# EAGLE design Grove expansion v5 (EAGLE 9.5.0)

## Sheet 1 of 2
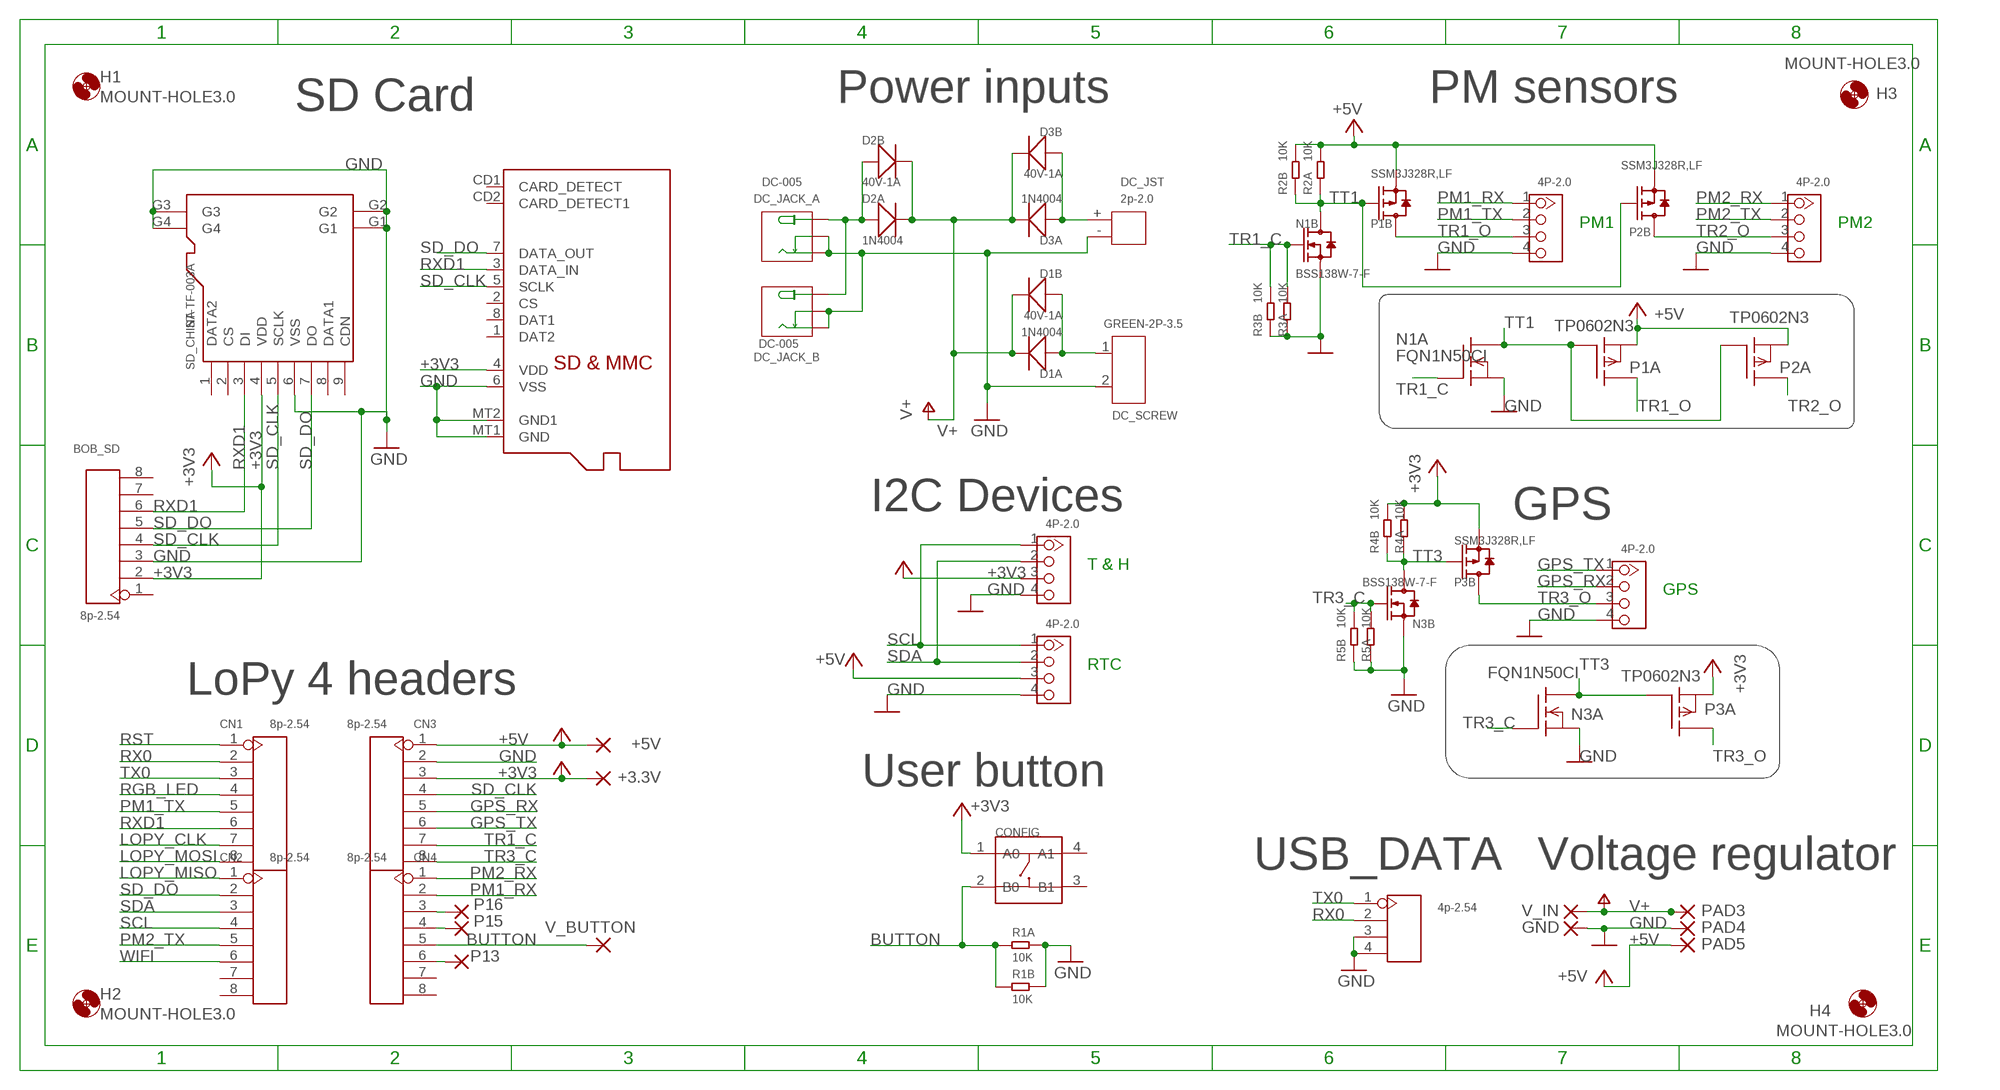
[diagram p0: schematic, sheet 1]

### Parts
+3.3V  3.3V  2,15/1,0  [2,15/1,0]
+5V  5V  2,15/1,0  [2,15/1,0]
BOB_SD  8p-2.54  DIP-BLACK-FEMALE-HEADER-VERT(8P-2.54)  [H8-2.54]
CN1  8p-2.54  DIP-BLACK-FEMALE-HEADER-VERT(8P-2.54)  [H8-2.54]
CN2  8p-2.54  DIP-BLACK-FEMALE-HEADER-VERT(8P-2.54)  [H8-2.54]
CN3  8p-2.54  DIP-BLACK-FEMALE-HEADER-VERT(8P-2.54)  [H8-2.54]
CN4  8p-2.54  DIP-BLACK-FEMALE-HEADER-VERT(8P-2.54)  [H8-2.54]
CONFIG  DIP-SWITCH-TACTILE-SPST-NO/TS-1109(4P-D6.0MM)'TS-1109'  [SW4-6.0X6.0X5.0MM]
D1A  1N4004  DIP-DIODE-400V-1A(DO-41)  [DO-41]
D1B  40V-1A  SMD-DIODE-SCHOTTKY-40V-1A(DO-214AC)  [DO-214AC]
D2A  1N4004  DIP-DIODE-400V-1A(DO-41)  [DO-41]
D2B  40V-1A  SMD-DIODE-SCHOTTKY-40V-1A(DO-214AC)  [DO-214AC]
D3A  1N4004  DIP-DIODE-400V-1A(DO-41)  [DO-41]
D3B  40V-1A  SMD-DIODE-SCHOTTKY-40V-1A(DO-214AC)  [DO-214AC]
DC_JACK_A  DC-005  CONN-POWER-JACK-2.1MM(DC-005)  [DCJ3P-14.2X11.0X9.0MM]
DC_JACK_B  DC-005  CONN-POWER-JACK-2.1MM(DC-005)  [DCJ3P-14.2X11.0X9.0MM]
DC_JST  2p-2.0  DIP-JST-2P-2.0  [H2-2.0-6X4.5MM]
DC_SCREW  GREEN-2P-3.5  SCREW-TERMINAL-GREEN(2P-3.5)  [H2-3.5-7.0X7.0MM]
GND  0V  2,15/1,0  [2,15/1,0]
GPS-(DIG)  4P-2.0  GROVE-CONNECTOR-DIP(4P-2.0)  [HW4-2.0]
H1  MOUNT-HOLE3.0  [3,0]
H2  MOUNT-HOLE3.0  [3,0]
H3  MOUNT-HOLE3.0  [3,0]
H4  MOUNT-HOLE3.0  [3,0]
N1A  FQN1N50CI  [TO92-INLINE]
N1B  BSS138W-7-F  SMD-MOSFET-N-CH-50V-200MA-BSS138W-7-F(SOT-23)  [SOT-23]
N3A  FQN1N50CI  [TO92-INLINE]
N3B  BSS138W-7-F  SMD-MOSFET-N-CH-50V-200MA-BSS138W-7-F(SOT-23)  [SOT-23]
P1A  TP0602N3  [TO-92]
P1B  SSM3J328R,LF  SMD-MOSFET-P-CH-20V-6A-SSM3J328R(SOT-23)  [SOT-23]
P2A  TP0602N3  [TO-92]
P2B  SSM3J328R,LF  SMD-MOSFET-P-CH-20V-6A-SSM3J328R(SOT-23)  [SOT-23]
P3A  TP0602N3  [TO-92]
P3B  SSM3J328R,LF  SMD-MOSFET-P-CH-20V-6A-SSM3J328R(SOT-23)  [SOT-23]
P13  2,15/1,0  [2,15/1,0]
P15  2,15/1,0  [2,15/1,0]
P16  2,15/1,0  [2,15/1,0]
PAD3  12V  1,6/0,8  [1,6/0,8]
PAD4  0V  1,6/0,8  [1,6/0,8]
PAD5  5V  1,6/0,8  [1,6/0,8]
PM1-(UART)  4P-2.0  GROVE-CONNECTOR-DIP(4P-2.0)  [HW4-2.0]
PM2-(UART)  4P-2.0  GROVE-CONNECTOR-DIP(4P-2.0)  [HW4-2.0]
R1A  10K  DIP-RES-10K-5%-1/4W(PR-D2.3XL6.5MM)  [PR-D2.3XL6.5MM]
R1B  10K  SMD-RES-10K-1%-1/10W(0603)  [R0603]
R2A  10K  DIP-RES-10K-5%-1/4W(PR-D2.3XL6.5MM)  [PR-D2.3XL6.5MM]
R2B  10K  SMD-RES-10K-1%-1/10W(0603)  [R0603]
R3A  10K  DIP-RES-10K-5%-1/4W(PR-D2.3XL6.5MM)  [PR-D2.3XL6.5MM]
R3B  10K  SMD-RES-10K-1%-1/10W(0603)  [R0603]
R4A  10K  DIP-RES-10K-5%-1/4W(PR-D2.3XL6.5MM)  [PR-D2.3XL6.5MM]
R4B  10K  SMD-RES-10K-1%-1/10W(0603)  [R0603]
R5A  10K  DIP-RES-10K-5%-1/4W(PR-D2.3XL6.5MM)  [PR-D2.3XL6.5MM]
R5B  10K  SMD-RES-10K-1%-1/10W(0603)  [R0603]
RTC-(I2C)  4P-2.0  GROVE-CONNECTOR-DIP(4P-2.0)  [HW4-2.0]
SD_CHINA  ST-TF-003A  MICRO-SD-CARD-SOCKET-9P(ST-TF-003A)  [MICRO-SD9+4P-SMD-16.1X14.5X1.85MM]
SD_UK  MICROSD  [MICROSD]
TH-(I2C)  4P-2.0  GROVE-CONNECTOR-DIP(4P-2.0)  [HW4-2.0]
USB_DATA  4p-2.54  DIP-BLACK-FEMALE-HEADER-VERT(4P-2.54)  [H4-2.54]
V_BUTTON  3.3V  2,15/1,0  [2,15/1,0]
V_IN  12V  2,15/1,0  [2,15/1,0]

### Nets
+3V3: +3.3V.1(P) BOB_SD.2 CN3.3 CONFIG.1(A0) P3A.1(S) P3B.2(S) R4A.2 R4B.2 SD_CHINA.4(VDD) SD_UK.4(VDD) TH-(I2C).3
+5V: +5V.1(P) CN3.1 P1A.1(S) P1B.2(S) P2A.1(S) P2B.2(S) PAD5.1(P) R2A.2 R2B.2 RTC-(I2C).3
BUTTON: CN4.5 CONFIG.2(B0) R1A.1 R1B.1 V_BUTTON.1(P)
GND: BOB_SD.3 CN3.2 DC_JACK_A.-1(-) DC_JACK_A.-2(CDN) DC_JACK_B.-1(-) DC_JACK_B.-2(CDN) DC_JST.- DC_SCREW.2 GND.1(P) GPS-(DIG).4 N1A.3(S) N1B.2(S) N3A.3(S) N3B.2(S) PAD4.1(P) PM1-(UART).4 PM2-(UART).4 R1A.2 R1B.2 R3A.1 R3B.1 R5A.1 R5B.1 RTC-(I2C).4 SD_CHINA.6(VSS) SD_CHINA.G1 SD_CHINA.G2 SD_CHINA.G3 SD_CHINA.G4 SD_UK.6(VSS) SD_UK.MT1(GND) SD_UK.MT2(GND1) TH-(I2C).4 USB_DATA.3 USB_DATA.4
GPS_RX: CN3.5 GPS-(DIG).2
GPS_TX: CN3.6 GPS-(DIG).1
JACK_V+: D2A.1(+) D2B.1(+) DC_JACK_A.+ DC_JACK_B.+
JST_V+: D3A.1(+) D3B.1(+) DC_JST.+
LOPY_CLK: CN1.7
LOPY_MISO: CN2.1
LOPY_MOSI: CN1.8
P13: CN4.6 P13.1(P)
P15: CN4.4 P15.1(P)
P16: CN4.3 P16.1(P)
PM1_RX: CN4.2 PM1-(UART).1
PM1_TX: CN1.5 PM1-(UART).2
PM2_RX: CN4.1 PM2-(UART).1
PM2_TX: CN2.5 PM2-(UART).2
RGB_LED: CN1.4
RST: CN1.1
RX0: CN1.2 USB_DATA.2
RXD1: BOB_SD.6 CN1.6 SD_CHINA.3(DI) SD_UK.3(DATA_IN)
SCL: CN2.4 RTC-(I2C).1 TH-(I2C).1
SCREW_V+: D1A.1(+) D1B.1(+) DC_SCREW.1
SD_CLK: BOB_SD.4 CN3.4 SD_CHINA.5(SCLK) SD_UK.5(SCLK)
SD_DO: BOB_SD.5 CN2.2 SD_CHINA.7(DO) SD_UK.7(DATA_OUT)
SDA: CN2.3 RTC-(I2C).2 TH-(I2C).2
TR1_C: CN3.7 N1A.2(G) N1B.1(G) R3A.2 R3B.2
TR1_O: P1A.3(D) P1B.3(D) PM1-(UART).3
TR2_O: P2A.3(D) P2B.3(D) PM2-(UART).3
TR3_C: CN3.8 N3A.2(G) N3B.1(G) R5A.2 R5B.2
TR3_O: GPS-(DIG).3 P3A.3(D) P3B.3(D)
TT1: N1A.1(D) N1B.3(D) P1A.2(G) P1B.1(G) P2A.2(G) P2B.1(G) R2A.1 R2B.1
TT3: N3A.1(D) N3B.3(D) P3A.2(G) P3B.1(G) R4A.1 R4B.1
TX0: CN1.3 USB_DATA.1
V+: D1A.2(-) D1B.2(-) D2A.2(-) D2B.2(-) D3A.2(-) D3B.2(-) PAD3.1(P) V_IN.1(P)
WIFI: CN2.6
Unconnected: BOB_SD.1 BOB_SD.7 BOB_SD.8 CN2.7 CN2.8 CN4.7 CN4.8 CONFIG.3(B1) CONFIG.4(A1) SD_CHINA.1(DATA2) SD_CHINA.2(CS) SD_CHINA.8(DATA1) SD_CHINA.9(CDN) SD_UK.1(DAT2) SD_UK.2(CS) SD_UK.8(DAT1) SD_UK.CD1(CARD_DETECT) SD_UK.CD2(CARD_DETECT1)

### Notes on the sheet
- SD Card | Power inputs | PM sensors
- PM1 | PM2
- I2C Devices | GPS
- T & H
- GPS
- RTC
- LoPy 4 headers
- User button
- Voltage regulator

## Sheet 2 of 2

## Library data of the parts
+3.3V +5V GND P13 P15 P16 V_BUTTON V_IN = wirepad:2,15/1,0: THROUGH-HOLE PAD
BOB_SD CN1-CN4 = OPL_Connector:DIP-BLACK-FEMALE-HEADER-VERT(8P-2.54): 320030061; MPN: F185-1108A1BSYC1
CONFIG = OPL_Switch:DIP-SWITCH-TACTILE-SPST-NO/TS-1109(4P-D6.0MM): 311020024
D1A D2A D3A = OPL_Discrete_Semiconductor:DIP-DIODE-400V-1A(DO-41): 304010008; MPN: 1N4004
D1B D2B D3B = OPL_Discrete_Semiconductor:SMD-DIODE-SCHOTTKY-40V-1A(DO-214AC): 304020027; MPN: 1N5819
DC_JACK_A DC_JACK_B = OPL_Connector:CONN-POWER-JACK-2.1MM(DC-005): 320120003; MPN: DC-005
DC_JST = OPL_Connector:DIP-JST-2P-2.0: 320110049
DC_SCREW = OPL_Connector:SCREW-TERMINAL-GREEN(2P-3.5): 320110028
GPS-(DIG) PM1-(UART) PM2-(UART) RTC-(I2C) TH-(I2C) = OPL_Connector:GROVE-CONNECTOR-DIP(4P-2.0): 320110033
H1-H4 = holes:MOUNT-HOLE: MOUNTING HOLE with drill center marker
N1A N3A = adafruit:FQN1N50C: N-Channel Enhancement MOSFET 500V, 0.4A, 6.0 Ohm
N1B N3B = OPL_Discrete_Semiconductor:SMD-MOSFET-N-CH-50V-200MA-BSS138W-7-F(SOT-23): 305030000; MPN: BSS138W-7-F
P1A P2A P3A = transistor-fet:TP0602N3: P-Channel Enhancement MOSFET -20V; -2A; 2,0Ohm
P1B P2B P3B = OPL_Discrete_Semiconductor:SMD-MOSFET-P-CH-20V-6A-SSM3J328R(SOT-23): 305030075; MPN: SSM3J328R,LF
PAD3-PAD5 = wirepad:1,6/0,8: THROUGH-HOLE PAD
R1A R2A R3A R4A R5A = OPL_Resistor:DIP-RES-10K-5%-1/4W(PR-D2.3XL6.5MM): 301020001; MPN: FHCFR-1/4W-103J
R1B R2B R3B R4B R5B = OPL_Resistor:SMD-RES-10K-1%-1/10W(0603): 301011970; MPN: RC0603FR-0710KL
SD_CHINA = OPL_Connector:MICRO-SD-CARD-SOCKET-9P(ST-TF-003A): 320090000; MPN: ST-TF-003A
SD_UK = adafruit:MICROSD: Micro-SD / Transflash card holder with SPI pinout For the 3M # 2908-05WB-MG and/or 4UCON #19656 push-push type
USB_DATA = OPL_Connector:DIP-BLACK-FEMALE-HEADER-VERT(4P-2.54): 320030017; MPN: F185-1104A1BSYA1

## Board
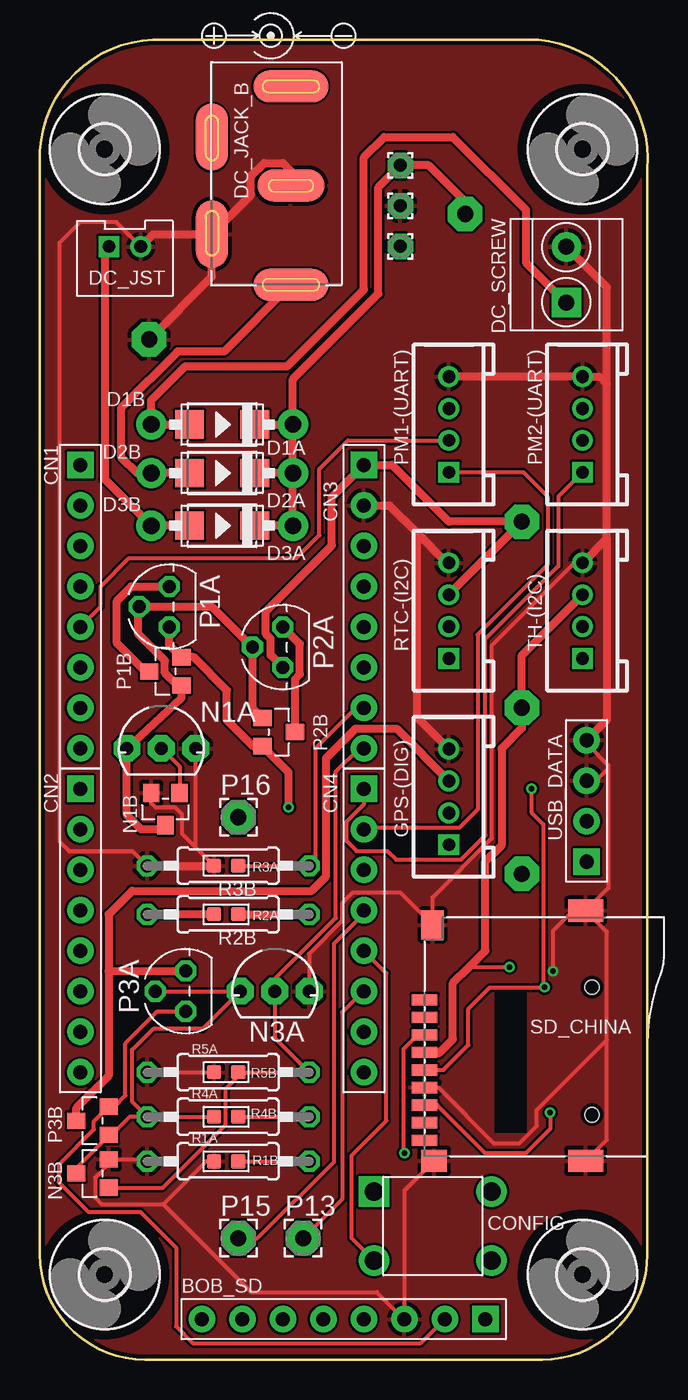
[diagram p1: board, top side]
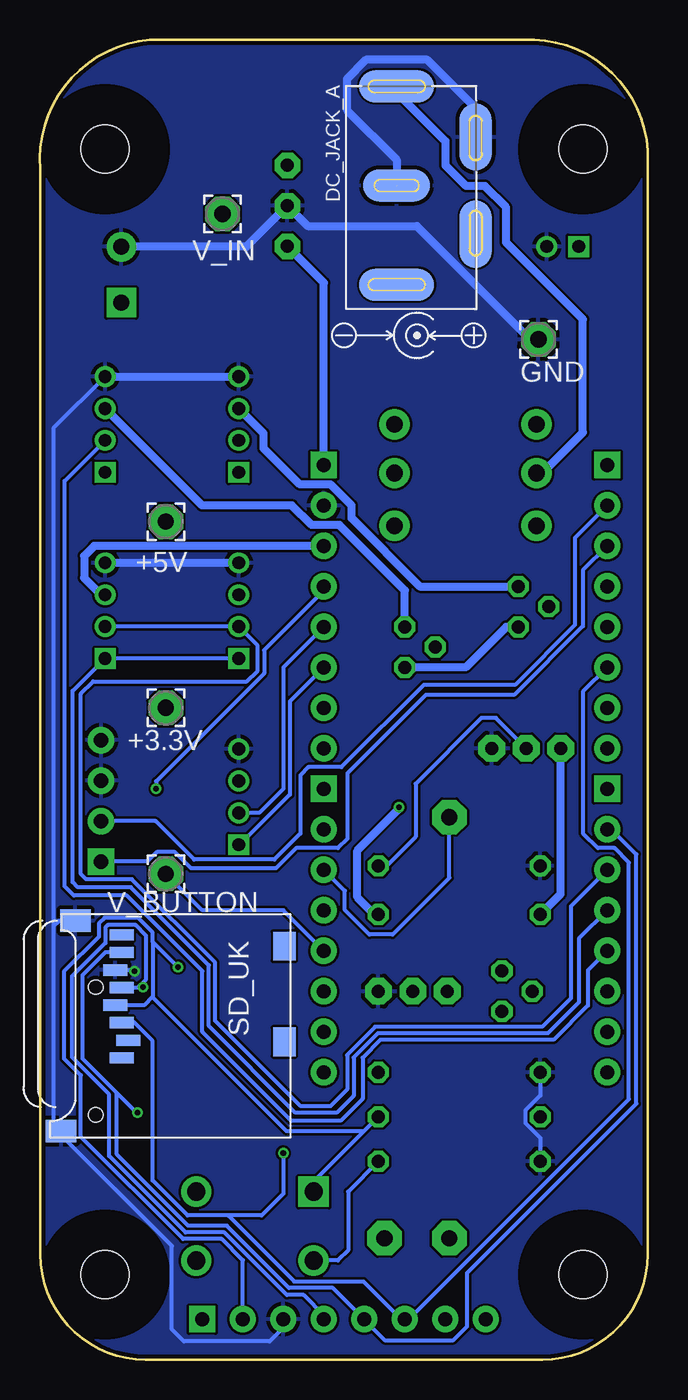
[diagram p2: board, bottom side, seen from below]

Size 38.13 x 82.8 mm. Coordinates in mm from the lower left corner, seen from the top.
Outline: 0,6.6 0,75.18 arc-90 7.11,82.8 31.24,82.8 arc-90 38.1,74.68 38.1,6.6 arc-90 31.5,0 6.6,0 arc-90 0,6.6
Copper layers (1*16): Top 0.035mm / dielectric 1.5mm / Bottom 0.035mm
Design rules "SeeedStudio_2layer_DRU_no_angle_20140221": minimum track width 6mil, minimum drill 12mil, track to track 6mil, track to pad 6mil, pad to pad 6mil, via to via 6mil, smd to smd 0mil, copper to edge 10mil, drill to drill 10mil, minimum pad ring 10mil, minimum via ring 6mil, stop-mask expansion 2mil, vias tented up to drill 100mil, thermal gap 10mil

### Footprints (pad centres in the part's own frame; a part is rotated, then mirrored left to right if it is on the bottom)
2,15/1,0 = drill 1.016 pad 2.159 octagon: 1 0,0
H8-2.54 = drill 0.889 pad 1.651 square: 1 0,8.89 | drill 0.889 pad 1.651: 2 0,6.35; 3 0,3.81; 4 0,1.27; 5 0,-1.27; 6 0,-3.81; 7 0,-6.35; 8 0,-8.89
SW4-6.0X6.0X5.0MM = drill 1.143 pad 1.905 square: 1 -3.683,2.159 | drill 1.143 pad 1.905: 2 -3.683,-2.159; 3 3.683,-2.159; 4 3.683,2.159
DO-41 = drill 1.041 pad 1.905: 1 -4.445,0; 2 4.445,0
DO-214AC = smd 1.8 x 1.77: 1 -2.042,0; 2 2.042,0
DCJ3P-14.2X11.0X9.0MM = smd 2 x 4.7: + 3.175,0 | smd 2 x 4.7 bottom: +1 3.175,0 | smd 2 x 4.2: -1 -3.048,0 | smd 4.2 x 2: -2 0,-4.953 | smd 2 x 4.2 bottom: -3 -3.048,0 | smd 4.2 x 2 bottom: -4 0,-4.953
H2-2.0-6X4.5MM = drill 0.8 pad 1.3 square: + -1,0.75 | drill 0.8 pad 1.3: - 1,0.75
H2-3.5-7.0X7.0MM = drill 1 pad 1.85 square: 1 -1.75,0 | drill 1 pad 1.85: 2 1.75,0
HW4-2.0 = drill 0.8 pad 1.27 square: 1 -3,0 | drill 0.8 pad 1.27: 2 -1,0; 3 1,0; 4 3,0
3,0 = hole 3: 0,0
TO92-INLINE = drill 0.813 pad 1.676 octagon: 1 -2.159,0; 2 0,0; 3 2.159,0
SOT-23 = smd 1.016 x 1.143: 1 -0.889,-1.016; 2 0.889,-1.016; 3 0,1.016
TO-92 = drill 0.813 octagon: 1 -1.27,0; 2 0,1.905; 3 1.27,0
1,6/0,8 = drill 0.813 pad 1.6 octagon: 1 0,0
PR-D2.3XL6.5MM = drill 0.813 octagon: 1 -4.953,0; 2 5.207,0
R0603 = smd 0.889 x 0.889: 1 0,0.762; 2 0,-0.762
MICRO-SD9+4P-SMD-16.1X14.5X1.85MM = smd 1.6 x 0.7: 1 0,2.25; 2 0,1.15; 3 0,0.05; 4 0,-1.05; 5 0,-2.15; 6 0,-3.25; 7 0,-4.35; 8 0,-5.45; 9 0,-6.55 | smd 1.6 x 1.4: G1 0.6,-7.85 | smd 2.2 x 1.4: G2 10.1,-7.85; G3 10.1,7.85 | smd 1.4 x 1.8: G4 0.5,6.95 | hole 0.9: 10.5,-4.95; 10.5,3.05
MICROSD = smd 0.7 x 1.5: 1 9,-10.64; 2 7.9,-10.24; 3 6.8,-10.64; 4 5.7,-11.04; 5 4.6,-10.64; 6 3.5,-11.04; 7 2.4,-10.64; 8 1.3,-10.64 | smd 1.8 x 1.4: CD1 2,-0.44; CD2 8,-0.44 | smd 1.4 x 1.9: MT1 0.4,-13.54; MT2 13.6,-14.44
H4-2.54 = drill 0.889 pad 1.651 square: 1 0,3.81 | drill 0.889 pad 1.651: 2 0,1.27; 3 0,-1.27; 4 0,-3.81

### Placement (x,y rotation side)
+3.3V  30.23,40.89 0 bottom
+5V  30.23,52.58 0 bottom
BOB_SD  19.05,2.54 270 top
CN1  2.54,47.24 0 top
CN2  2.54,26.92 0 top
CN3  20.32,47.24 0 top
CN4  20.32,26.92 0 top
CONFIG  24.64,8.38 0 top
D1A  11.43,58.67 0 top
D1B  11.43,58.67 0 top
D2A  11.43,55.63 0 top
D2B  11.43,55.63 0 top
D3A  11.43,52.32 0 top
D3B  11.43,52.32 0 top
DC_JACK_A  15.75,76.71 90 bottom
DC_JACK_B  15.75,70.61 270 top
DC_JST  5.33,69.09 0 top
DC_SCREW  33.02,68.07 90 top
GND  6.86,64.01 0 bottom
GPS-(DIG)  25.65,35.31 90 top
H1  34.04,5.33 0 top
H2  4.06,75.95 0 top
H3  34.04,75.95 0 top
H4  4.06,5.33 0 top
N1A  7.62,38.35 0 top
N1B  7.87,34.54 180 top
N3A  14.73,23.11 0 top
N3B  3.3,11.68 90 top
P1A  8.13,47.24 90 top
P1B  7.87,43.18 90 top
P2A  15.24,44.7 90 top
P2B  14.99,39.37 270 top
P3A  9.14,23.11 90 top
P3B  3.3,14.99 90 top
P13  16.51,7.62 0 top
P15  12.45,7.62 0 top
P16  12.45,34.04 0 top
PAD3  22.61,74.93 90 top
PAD4  22.61,72.39 90 top
PAD5  22.61,69.85 90 top
PM1-(UART)  25.65,58.67 90 top
PM2-(UART)  34.04,58.67 90 top
R1A  11.94,12.45 180 top
R1B  11.68,12.45 270 top
R2A  11.68,27.94 0 top
R2B  11.68,27.94 90 top
R3A  11.68,30.99 0 top
R3B  11.68,30.99 90 top
R4A  11.68,15.24 0 top
R4B  11.68,15.24 90 top
R5A  11.68,18.03 0 top
R5B  11.68,18.03 90 top
RTC-(I2C)  25.65,46.99 90 top
SD_CHINA  24.13,20.32 0 top
SD_UK  22.35,27.94 270 bottom
TH-(I2C)  34.04,46.99 90 top
USB_DATA  34.29,35.05 180 top
V_BUTTON  30.23,30.48 0 bottom
V_IN  26.67,71.88 0 bottom

### Tracks (layer width: path | path; a pad name or v marks a point on that pad's centre or on a via)
+3V3  (via drill 0.35)
  Top 0.254: BOB_SD.2 23.89,1.03 9.6,1.03 8.55,2.08 8.55,7.03 6.31,9.27 3.04,9.27 1.18,11.13 1.18,12.23 3.39,14.44 3.39,14.95 P3B.2 4.66,15.88 5.36,16.58 5.36,19.84 7.37,21.84 P3A.1 | R4B.2 R4A.2 | 25.05,19.23 24.17,19.23 SD_CHINA.4 | 26.92,24.64 v29.46,24.64
  Top 0.508: 25.05,19.23 25.91,20.1 25.91,23.62 26.92,24.64 27.94,25.65 27.94,31.24 28.96,32.26 28.96,38.35 30.23,39.62 +3.3V.1 30.23,44.18 TH-(I2C).3
  Bottom 0.254: 31.05,26.22 31.05,22.77 31.07,22.75 | 31.07,22.75 31.58,22.24 SD_UK.4 | BOB_SD.2 25.4,6.25 26.73,7.58 29.15,7.58 35.56,13.99 35.56,17.85 36.61,18.9 36.61,24.35 34.43,26.53 34.43,27.36 34.07,27.72 31.97,27.72 31.05,26.8 31.05,26.22 | 31.07,22.75 22.65,14.33 17.83,14.33 16.91,15.24 R4A.2 20.95,11.18 CONFIG.1 | v29.46,24.64 31.05,26.22
  Bottom 0.508: TH-(I2C).3 34.3,47.99 35.35,49.04 35.35,50.43 34.73,51.05 CN3.3
+5V  (via drill 0.35)
  Top 0.508: R2B.2 R2A.2 | RTC-(I2C).3 30.23,52.56 +5V.1 25.65,52.58 22.1,56.13 CN3.1 18.31,54.13 18.31,51.08 14.17,46.94 14.17,45.53 14.48,45.23 14.48,44.2 P2A.1 | v15.61,34.66 15.61,36.84 P2B.2 13.39,38.48 11.73,40.13 11.73,41.99 9.65,44.07 P1B.2 8.13,44.83 P1A.1
  Bottom 0.508: CN3.1 20.32,67.56 PAD5.1 | v15.61,34.66 15.61,34.54 18.21,31.94 18.21,29.01 17.14,27.94 R2A.2 | P1A.1 8.89,45.97 11.43,43.43 P2A.1
BUTTON
  Top 0.254: CN4.5 21.73,24.24 21.73,14.99 19.56,12.81 19.56,7.62 CONFIG.2 | R1B.1 R1A.1
  Bottom 0.254: V_BUTTON.1 27.94,28.19 22.86,28.19 CN4.5 | R1A.1 18.8,10.54 18.8,6.86 19.43,6.22 CONFIG.2
GND  (via drill 0.35)  (1 unrouted)
  Top 0.254: 24.73,12.82 SD_CHINA.G1 22.86,10.6 BOB_SD.3 22.86,2.5 21.13,4.23 13.26,4.23 7.74,9.75 | DC_JST.- 4.8,71.37 2.54,71.37 1.22,70.05 1.22,32.52 1.83,31.92 5.8,31.92 R3A.1 | USB_DATA.4 34.29,38.65 35.65,37.29 35.65,37.08 | 35.65,37.08 35.65,29.59 SD_CHINA.G3 | 11.23,18.03 R5B.1 R5A.1 | SD_CHINA.G3 35.56,26.84 35.56,20.07 | SD_CHINA.G3 33.44,28.17 32.19,26.92 v32.19,24.38 | SD_CHINA.G2 35.56,13.8 35.56,20.07 | SD_CHINA.6 24.99,17.07 28.48,13.58 30.07,13.58 31.16,14.67 31.16,15.67 35.56,20.07 | R1A.2 6.6,12.57 N3B.2 4.45,12.45 4.45,12.4 3.47,11.42 3.47,10.17 3.88,9.75 7.74,9.75 | TH-(I2C).4 33.53,49.99 28.35,44.81 28.35,32.72 24.63,29 SD_CHINA.G4 22.6,29.3 19.61,29.3 18.97,28.66 18.97,27.54 16.89,25.46 N3A.3 | R1B.2 10.43,12.45 7.74,9.75 | USB_DATA.3 34.89,36.32 35.65,37.08 | 6.73,35.31 N1B.2 6.99,34.92 7.28,34.63 8.5,34.63 8.91,34.21 8.91,32.99 R3B.1 9.78,32.13 N1A.3
  Top 0.508: DC_JST.- 7.11,70.61 DC_JACK_B.-2 | DC_JACK_B.-2 13.24,73.06 13.24,74.24 14.06,75.07 15.25,75.07 15.75,74.57 DC_JACK_B.-1 | N1B.2 7.06,35.64 | R3A.1 R3B.1 | 35.56,51.51 TH-(I2C).4 | 35.56,51.51 35.56,40.13 USB_DATA.4 | CN3.2 21.93,53.59 23.66,51.86 | RTC-(I2C).4 25.53,49.99 23.66,51.86 | DC_SCREW.2 35.56,67.28 35.56,61.21 | PM1-(UART).4 PM2-(UART).4 35.1,61.67 35.56,61.21 | GPS-(DIG).4 23.66,40.3 23.66,51.86 | GND.1 10.79,67.95 DC_JACK_B.-2 | 35.56,51.51 35.56,61.21
  Bottom 0.254: PM2-(UART).4 37.27,58.44 37.27,27.18 | 37.27,27.18 37.27,14.67 36.95,14.34 SD_UK.MT2 36.79,14.09 29.84,7.14 29.84,1.89 29.1,1.14 23.71,1.14 22.86,1.99 BOB_SD.3 | SD_UK.6 32.25,24.44 v32.19,24.38 | R5A.1 6.73,16.57 7.67,15.63 7.67,14.85 6.73,13.91 R1A.2 | SD_UK.MT1 36.91,27.54 37.27,27.18
  Bottom 0.508: DC_JACK_A.-2 10.79,78.52 13.81,81.54 17.68,81.54 18.88,80.35 18.88,78.4 15.75,75.27 DC_JACK_B.-1 | RTC-(I2C).4 TH-(I2C).4 | GND.1 7.37,64.01 14.48,71.12 21.34,71.12 PAD4.1 25.17,69.82 DC_SCREW.2 | PM1-(UART).4 PM2-(UART).4 33.32,61.67
  pour Top: -1.27,85.34 -1.27,-1.02 39.37,-1.02 39.37,85.34
  pour Bottom: -2.79,86.61 -2.79,-2.29 40.64,-2.29 40.64,86.61
GPS_RX
  Bottom 0.254: CN3.5 22.86,43.43 22.86,35.81 24.37,34.31 GPS-(DIG).2
GPS_TX
  Bottom 0.254: CN3.6 22.45,41.3 22.45,35.46 25.61,32.31 GPS-(DIG).1
JACK_V+
  Top 0.508: D2B.1 D2A.1 6.1,55.63 5.08,56.64 5.08,59.69 8.64,63.25 11.56,63.25 DC_JACK_B.+
  Bottom 0.508: DC_JACK_A.+ 15.75,79.5 12.7,76.45 12.7,74.93 11.4,73.63 10.21,73.63 8.88,72.3 8.88,70.09 4.06,65.28 4.06,58.17 6.6,55.63 D2A.1
JST_V+
  Top 0.508: D3B.1 D3A.1 4.06,55.24 4.06,69.57 DC_JST.+
P13
  Top 0.254: CN4.6 20.28,23.11 18.96,21.79 18.96,10.07 P13.1
P15
  Top 0.254: P15.1 13.65,7.62 18.45,12.42 18.45,26.11 20.32,27.98 CN4.4
P16
  Bottom 0.254: CN4.3 19,29.41 19,28.21 17.46,26.67 16,26.67 12.45,30.23 P16.1
PM1_RX
  Top 0.254: PM1-(UART).1 30.32,55.67 31.84,54.16 31.84,49.87 27.45,45.48 27.45,34.53 26.3,33.37 20.42,33.37 CN4.2
PM1_TX
  Top 0.254: CN1.5 3.81,47.24 3.81,48.51 5.59,50.29 16.09,50.29 17.53,51.72 17.53,55.88 19.32,57.67 PM1-(UART).2
PM2_RX
  Top 0.254: CN4.1 20.32,34.84 19.21,33.73 19.21,32.56 19.86,31.92 21.8,31.92 22.34,31.37 26.42,31.37 27.94,32.89 27.94,45.21 32.51,49.79 32.51,54.15 PM2-(UART).1
PM2_TX
  Bottom 0.254: PM2-(UART).2 36.58,55.13 36.58,29.7 35.99,29.12 32.68,29.12 27.94,24.38 27.94,20.57 22.35,14.99 19.27,14.99 17.89,16.36 17.89,18.94 16.76,20.07 5.91,20.07 3.76,22.22 3.76,24.44 CN2.5
RX0
  Bottom 0.254: CN1.2 4.57,51.56 4.57,46.09 8.32,42.34 14.05,42.34 19.21,37.17 21.29,37.17 21.79,36.66 21.79,33 23.43,31.37 28.46,31.37 30.86,33.78 USB_DATA.2
RXD1  (via drill 0.35)
  Top 0.254: SD_CHINA.3 24.09,20.41 23.72,20.41 22.8,19.48 22.8,13.02 v22.86,12.95
  Bottom 0.254: SD_UK.3 32.95,21.18 32.23,21.18 31.05,20 31.05,11.24 28.87,9.05 26.33,9.05 | 26.33,9.05 22.19,4.91 17.83,4.91 15.46,2.54 BOB_SD.6 14.99,2.54 1.18,16.35 1.18,31.19 2.08,32.09 3.14,32.09 4.06,33.02 4.06,41.91 CN1.6 | v22.86,12.95 22.86,10.41 24.22,9.05 26.33,9.05
SCL
  Bottom 0.254: CN2.4 4.32,26.42 4.32,22.42 6.27,20.47 16.93,20.47 18.45,18.95 18.45,16.56 19.52,15.49 22.1,15.49 27.53,20.93 27.53,24.74 32.42,29.63 35.74,29.63 36.07,29.96 36.07,41.96 TH-(I2C).1 RTC-(I2C).1
SCREW_V+
  Top 0.508: D1B.1 D1A.1 6.99,60.2 9.12,62.33 15.51,62.33 20.32,67.15 20.32,75.44 21.59,76.71 25.91,76.71 30.48,72.14 30.48,68.83 32.99,66.32 DC_SCREW.1
SD_CLK  (via drill 0.35)
  Top 0.254: 31.59,23.44 v31.66,23.37 | v30.83,35.81 30.83,34.34 31.59,33.58 31.59,23.44 | SD_CHINA.5 25.3,18.17 26.88,19.75 26.88,22 28.22,23.35 31.49,23.35 31.59,23.44
  Bottom 0.254: BOB_SD.4 20.32,2.79 21.59,4.06 22.64,4.06 26.56,7.98 28.98,7.98 33.78,12.79 33.78,16.64 36.12,18.98 36.12,24.04 34.02,26.13 34.02,27.11 33.86,27.27 32.13,27.27 31.45,26.6 31.45,23.87 31.98,23.34 SD_UK.5 32.96,23.37 v31.66,23.37 | CN3.4 20.32,48.26 24.06,44.52 24.06,43.05 30.83,36.28 v30.83,35.81
SD_DO  (via drill 0.35)
  Top 0.254: v32,15.49 32,14.48 30.48,12.95 27.94,12.95 24.92,15.97 SD_CHINA.7
  Bottom 0.254: SD_UK.7 33.03,25.58 34,25.58 35.46,24.12 35.46,18.9 33.3,16.74 | 33.3,16.74 33.3,12.88 28.82,8.4 26.4,8.4 22.51,4.51 19.75,4.51 BOB_SD.5 17.78,2.5 16.5,1.22 12.19,1.22 11.34,2.07 11.34,5.42 0.71,16.05 0.71,31.7 2.29,33.27 CN2.2 | 33.3,16.74 32.06,15.49 v32,15.49
SDA
  Bottom 0.254: CN2.3 4.83,28.45 4.83,22.67 6.62,20.88 17.1,20.88 18.86,19.12 18.86,16.96 19.91,15.9 21.76,15.9 27.13,21.26 27.13,24.91 32.36,30.14 35.23,30.14 35.56,30.47 35.56,41.78 34.79,42.55 25.14,42.55 24.47,43.22 24.47,44.8 RTC-(I2C).2 TH-(I2C).2
TR1_C
  Top 0.254: CN3.7 19.81,40.89 17.27,38.35 17.27,31.24 17.02,30.99 R3A.2 R3B.2 | N1A.2 8.76,37.21 N1B.1
  Bottom 0.254: R3A.2 16.38,30.99 14.57,32.8 14.57,36.12 10.43,40.26 9.53,40.26 N1A.2
TR1_O
  Top 0.508: P1B.3 6.6,43.18 4.83,44.96 4.83,47.61 5.73,48.51 P1A.3
  Bottom 0.508: PM1-(UART).3 24.09,58.11 24.09,57.17 21.82,54.9 19.89,54.9 18.58,53.6 18.58,52.79 14.31,48.51 P1A.3
TR2_O
  Top 0.508: P2A.3 16.31,44.91 16.31,42.99 16,42.69 P2B.3
  Bottom 0.508: PM2-(UART).3 27.96,53.59 22.32,53.59 21.08,52.36 19.34,52.36 15.24,48.26 P2A.3
TR3_C
  Top 0.254: CN3.8 20.03,38.35 18.57,36.89 18.57,27.71 14.73,23.88 N3A.2 14.73,20.19 R5A.2 12.7,18.03 | R5B.2 12.7,18.03 | 12.7,18.03 11.65,16.98 11.65,14.74 7.7,10.79 N3B.1
TR3_O
  Top 0.508: GPS-(DIG).3 22.37,39.59 19.81,39.59 17.96,37.73 17.96,30.33 17.04,29.41 5.79,29.41 4.32,27.94 4.32,24.38 | P3B.3 2.29,15.78 4.32,17.82 4.32,24.38 | 4.32,24.38 P3A.3
TT1
  Top 0.254: 7.62,33.27 N1B.3
  Top 0.508: R2B.1 R2A.1 | P2B.1 13.34,40.89 P2A.2 10.79,47.24 P1A.2 6.17,47.19 6.17,45.52 7.84,43.86 7.84,43.09 8.64,42.29 P1B.1 8.89,41.53 N1A.1 5.46,34.16 6.35,33.27 7.62,33.27
  Bottom 0.508: R2A.1 5.46,29.21 N1A.1
TT3
  Top 0.254: R4A.1 R4B.1 | N3B.3 2.29,12.02 4.32,14.05 P3B.1 4.52,14.1 5.68,15.25 5.69,15.24 R4A.1 | R4A.1 5.79,16.18 5.79,19.44 7.1,20.75 10.21,20.75 N3A.1 P3A.2
TX0
  Bottom 0.254: USB_DATA.1 31.39,31.24 30.79,31.84 29.66,31.84 28.65,30.82 23.32,30.82 22.05,32.09 19.43,32.09 18.85,32.68 18.85,36.78 13.92,41.71 8.38,41.71 4.06,46.02 4.06,49.53 CN1.3
V+
  Top 0.508: D1B.2 D1A.2 | D2A.2 D2B.2 | D3B.2 D3A.2 D2A.2 | D2A.2 D1A.2 | D1A.2 15.88,61.51 21.23,66.87 21.23,73.56 PAD3.1 24.38,74.93 26.67,72.64 V_IN.1

### Text on the board
silktop: PyonAir V5 | 6.5 - 40 V | . | + | + | - | V-reg | + | - | Wires in | + | LoPy / LED | +5V | +5V | + | +5V | 3V3 | S | S | - GND | S | GND | 3V3 | - RX - | TX | V_Button | S | S | x / x | x / x | DI | DO | CLK | GND | 3V3
silkbottom: + | + | - | CC-BY-SA | + | - | + | pyonair.org | University of / Southampton | https://github.com/pyonair